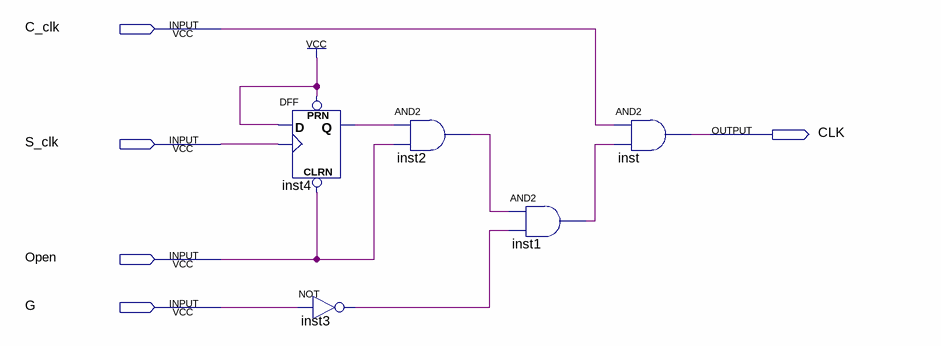
[diagram p0: schematic sheet]
// Quartus schematic start_end.bdf as structural Verilog: 5 symbols, 5 pins
module start_end (
  input  C_clk,
  input  S_clk,
  input  Open,
  input  G,
  output CLK
);

  wire inst1_out, inst2_out, inst3_out, inst4_q;

  DFF inst4 (.CLRN(Open), .CLK(S_clk), .D(1'b1), .PRN(1'b1), .Q(inst4_q));
  not inst3 (inst3_out, G);
  and inst2 (inst2_out, inst4_q, Open);
  and inst1 (inst1_out, inst2_out, inst3_out);
  and inst (CLK, C_clk, inst1_out);
endmodule
